# EAGLE design Sequencer2 (EAGLE 9.6.2)
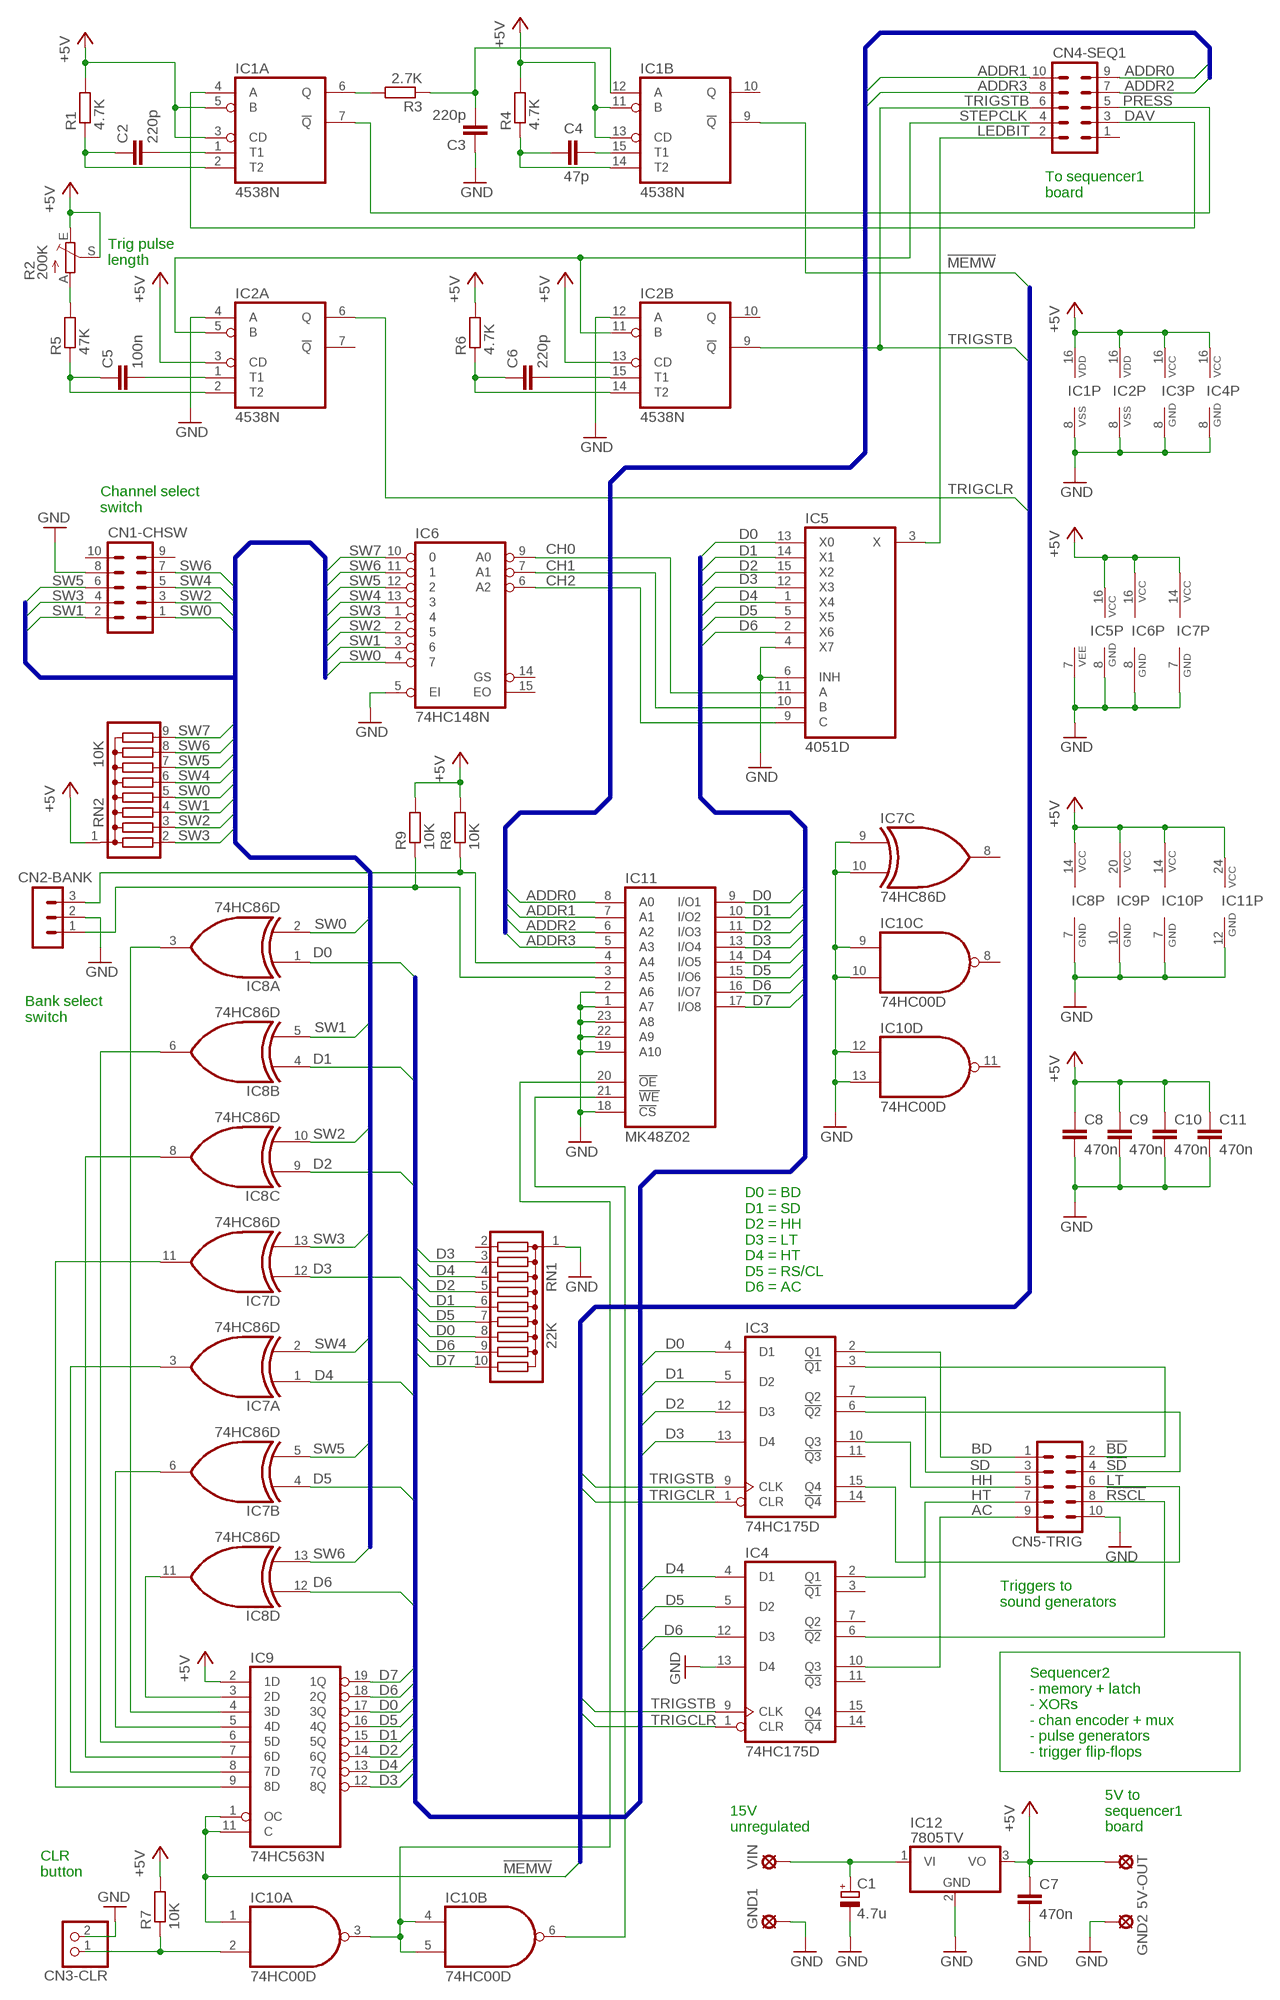
[diagram p0: schematic, sheet 1]

## Parts
5V-OUT  LSP10  [LSP10]
C1  4.7u  CPOL-EUSMCA  [SMC_A]
C2  220p  C-EUC0805  [C0805]
C3  220p  C-EUC0805  [C0805]
C4  47p  C-EUC0805  [C0805]
C5  100n  C-EUC0805  [C0805]
C6  220p  C-EUC0805  [C0805]
C7  470n  C-EUC0603  [C0603]
C8  470n  C-EUC0603  [C0603]
C9  470n  C-EUC0603  [C0603]
C10  470n  C-EUC0603  [C0603]
C11  470n  C-EUC0603  [C0603]
CN1-CHSW  MA05-2  [MA05-2]
CN2-BANK  MA03-1  [MA03-1]
CN3-CLR  PINHD-1X2  [1X02]
CN4-SEQ1  MA05-2  [MA05-2]
CN5-TRIG  MA05-2  [MA05-2]
GND1  LSP10  [LSP10]
GND2  LSP10  [LSP10]
IC1  4538N  [DIL16]
IC2  4538N  [DIL16]
IC3  74HC175D  [SO16]
IC4  74HC175D  [SO16]
IC5  4051D  [SO16]
IC6  74HC148N  74LS148N  [DIL16]
IC7  74HC86D  74LS86D  [SO14]
IC8  74HC86D  74LS86D  [SO14]
IC9  74HC563N  [DIL20]
IC10  74HC00D  74ALS00D  [SO14]
IC11  MK48Z02  6116P  [DIL24-6]
IC12  7805TV  [TO220V]
R1  4.7K  R-EU_R0805  [R0805]
R2  200K  TRIM_EU-S63X  [S63X]
R3  2.7K  R-EU_R0805  [R0805]
R4  4.7K  R-EU_R0805  [R0805]
R5  47K  R-EU_R0805  [R0805]
R6  4.7K  R-EU_R0805  [R0805]
R7  10K  R-EU_R0805  [R0805]
R8  10K  R-EU_R0805  [R0805]
R9  10K  R-EU_R0805  [R0805]
RN1  22K  G09R  [SIL10]
RN2  10K  G08R  [SIL9]
VIN  LSP10  [LSP10]

## Nets
!BD: CN5-TRIG.2 IC3.3(!Q1)
!MEMW: IC1.9(B:!Q) IC9.1(OC) IC9.11(C) IC10.1(A:I0)
!PRESS: CN4-SEQ1.5 IC1.7(A:!Q)
!RSCL: CN5-TRIG.8 IC4.6(!Q2)
!SD: CN5-TRIG.4 IC3.6(!Q2)
+5V: 5V-OUT.MP C7.1 C8.1 C9.1 C10.1 C11.1 IC1.3(A:CD) IC1.5(A:B) IC1.11(B:B) IC1.13(B:CD) IC1.16(P:VDD) IC2.3(A:CD) IC2.13(B:CD) IC2.16(P:VDD) IC3.16(VCC) IC4.16(VCC) IC5.16(VCC) IC6.16(VCC) IC7.14(P:VCC) IC8.14(P:VCC) IC9.2(1D) IC9.20(VCC) IC10.14(P:VCC) IC11.24(VCC) IC12.3(VO) R1.2 R2.E R2.S R4.2 R6.2 R7.2 R8.2 R9.2 RN2.1
AC: CN5-TRIG.9 IC4.10(Q3)
ADDR0: CN4-SEQ1.9 IC11.8(A0)
ADDR1: CN4-SEQ1.10 IC11.7(A1)
ADDR2: CN4-SEQ1.7 IC11.6(A2)
ADDR3: CN4-SEQ1.8 IC11.5(A3)
BD: CN5-TRIG.1 IC3.2(Q1)
CH0: IC5.11(A) IC6.9(A0)
CH1: IC5.10(B) IC6.7(A1)
CH2: IC5.9(C) IC6.6(A2)
D0: IC3.4(D1) IC5.13(X0) IC8.1(A:I0) IC9.17(3Q) IC11.9(I/O1) RN1.8
D1: IC3.5(D2) IC5.14(X1) IC8.4(B:I0) IC9.15(5Q) IC11.10(I/O2) RN1.6
D2: IC3.12(D3) IC5.15(X2) IC8.9(C:I0) IC9.14(6Q) IC11.11(I/O3) RN1.5
D3: IC3.13(D4) IC5.12(X3) IC7.12(D:I0) IC9.12(8Q) IC11.13(I/O4) RN1.3
D4: IC4.4(D1) IC5.1(X4) IC7.1(A:I0) IC9.13(7Q) IC11.14(I/O5) RN1.4
D5: IC4.5(D2) IC5.5(X5) IC7.4(B:I0) IC9.16(4Q) IC11.15(I/O6) RN1.7
D6: IC4.12(D3) IC5.2(X6) IC8.12(D:I0) IC9.18(2Q) IC11.16(I/O7) RN1.9
D7: IC9.19(1Q) IC11.17(I/O8) RN1.10
DAV: CN4-SEQ1.3 IC1.4(A:A)
GND: C1.- C3.1 C7.2 C8.2 C9.2 C10.2 C11.2 CN1-CHSW.8 CN2-BANK.2 CN3-CLR.2 CN5-TRIG.10 GND1.MP GND2.MP IC1.8(P:VSS) IC2.4(A:A) IC2.8(P:VSS) IC2.12(B:A) IC3.8(GND) IC4.8(GND) IC4.13(D4) IC5.4(X7) IC5.6(INH) IC5.7(VEE) IC5.8(GND) IC6.5(EI) IC6.8(GND) IC7.7(P:GND) IC7.9(C:I0) IC7.10(C:I1) IC8.7(P:GND) IC9.10(GND) IC10.7(P:GND) IC10.9(C:I0) IC10.10(C:I1) IC10.12(D:I0) IC10.13(D:I1) IC11.1(A7) IC11.2(A6) IC11.12(GND) IC11.18(!CS) IC11.19(A10) IC11.22(A9) IC11.23(A8) IC12.2(GND) RN1.1
HH: CN5-TRIG.5 IC3.10(Q3)
HT: CN5-TRIG.7 IC4.2(Q1)
LEDBIT: CN4-SEQ1.2 IC5.3(X)
LT: CN5-TRIG.6 IC3.15(Q4)
N$1: C5.2 IC2.1(A:T1)
N$2: C5.1 IC2.2(A:T2) R5.1
N$3: C2.2 IC1.1(A:T1)
N$4: C2.1 IC1.2(A:T2) R1.1
N$5: IC1.6(A:Q) R3.2
N$6: C3.2 IC1.12(B:A) R3.1
N$7: C4.2 IC1.14(B:T2) R4.1
N$8: C4.1 IC1.15(B:T1)
N$9: R2.A R5.2
N$10: C6.2 IC2.15(B:T1)
N$11: C6.1 IC2.14(B:T2) R6.1
N$15: IC8.3(A:O) IC9.4(3D)
N$16: IC8.6(B:O) IC9.6(5D)
N$17: IC8.8(C:O) IC9.7(6D)
N$18: IC7.11(D:O) IC9.9(8D)
N$19: IC7.3(A:O) IC9.8(7D)
N$20: IC7.6(B:O) IC9.5(4D)
N$21: IC8.11(D:O) IC9.3(2D)
N$22: CN2-BANK.1 IC11.3(A5) R9.1
N$23: CN3-CLR.1 IC10.2(A:I1) R7.1
N$24: C1.+ IC12.1(VI) VIN.MP
N$25: CN2-BANK.3 IC11.4(A4) R8.1
N$27: IC10.3(A:O) IC10.4(B:I0) IC10.5(B:I1) IC11.20(!OE)
N$28: IC10.6(B:O) IC11.21(!WE)
SD: CN5-TRIG.3 IC3.7(Q2)
STEPCLK: CN4-SEQ1.4 IC2.5(A:B) IC2.11(B:B)
SW0: CN1-CHSW.1 IC6.4 IC8.2(A:I1) RN2.5
SW1: CN1-CHSW.2 IC6.3 IC8.5(B:I1) RN2.4
SW2: CN1-CHSW.3 IC6.2 IC8.10(C:I1) RN2.3
SW3: CN1-CHSW.4 IC6.1 IC7.13(D:I1) RN2.2
SW4: CN1-CHSW.5 IC6.13 IC7.2(A:I1) RN2.6
SW5: CN1-CHSW.6 IC6.12 IC7.5(B:I1) RN2.7
SW6: CN1-CHSW.7 IC6.11 IC8.13(D:I1) RN2.8
SW7: IC6.10 RN2.9
TRIGCLR: IC2.6(A:Q) IC3.1(CLR) IC4.1(CLR)
TRIGSTB: CN4-SEQ1.6 IC2.9(B:!Q) IC3.9(CLK) IC4.9(CLK)
Unconnected: CN1-CHSW.9 CN1-CHSW.10 CN4-SEQ1.1 IC1.10(B:Q) IC2.7(A:!Q) IC2.10(B:Q) IC3.11(!Q3) IC3.14(!Q4) IC4.3(!Q1) IC4.7(Q2) IC4.11(!Q3) IC4.14(!Q4) IC4.15(Q4) IC6.14(GS) IC6.15(EO) IC7.8(C:O) IC10.8(C:O) IC10.11(D:O) RN1.2

## Buses
B$1
B$2
B$3
B$4

## Notes on the sheet
- To sequencer1
  board
- Trig pulse
  length
- Channel select
  switch
- Bank select
  switch
- D0 = BD
  D1 = SD
  D2 = HH
  D3 = LT
  D4 = HT
  D5 = RS/CL
  D6 = AC
- Triggers to
  sound generators
- Sequencer2
  - memory + latch
  - XORs
  - chan encoder + mux
  - pulse generators
  - trigger flip-flops
- 15V
  unregulated
- 5V to 
  sequencer1
  board
- CLR
  button

## Library data of the parts
5V-OUT GND1 GND2 VIN = solpad:LSP10: SOLDER PAD drill 1.0 mm, distributor Buerklin, 12H555
C1 = rcl:CPOL-EU: POLARIZED CAPACITOR, European symbol
C2-C11 = rcl:C-EU: CAPACITOR, European symbol
CN1-CHSW CN4-SEQ1 CN5-TRIG = con-lstb:MA05-2: PIN HEADER; OC_FARNELL: unknown; OC_NEWARK: unknown
CN2-BANK = con-lstb:MA03-1: PIN HEADER; OC_FARNELL: unknown; OC_NEWARK: unknown
CN3-CLR = pinhead:PINHD-1X2: PIN HEADER
IC1 IC2 = 45xx:4538: Dual precision monostable MULTIVIBRATOR
IC3 IC4 = 74xx-eu:74*175: Qadruple D type FLIP FLOP, clear
IC5 = 40xx:4051: 8-channel ANALOG MULTIPLEXER
IC6 = 74xx-us:74*148: 10-line to 4-line and 8-line to 3-line PRIORITY ENCODER
IC7 IC8 = 74xx-us:74*86: Quad 2-input EXCLUSIV-OR (XOR) gate
IC9 = 74xx-us:74*563: Inverting 8-bit D type LATCH
IC10 = 74xx-us:74*00: Quad 2-input NAND gate
IC11 = memory-idt:6116P: MEMORY; OC_FARNELL: unknown; OC_NEWARK: unknown
IC12 = linear:78*: Positive VOLTAGE REGULATOR Source: http://cache.national.com/ds/LM/LM78L05.pdf http://www.fairchildsemi.com/ds/LM/LM7805.pdf
R1 R3-R9 = rcl:R-EU_: RESISTOR, European symbol
R2 = pot:TRIM_EU-: POTENTIOMETER
RN1 = resistor-sil:G09R: SIL RESISTOR; OC_FARNELL: unknown; OC_NEWARK: unknown
RN2 = resistor-sil:G08R: SIL RESISTOR; OC_FARNELL: unknown; OC_NEWARK: unknown

## Board
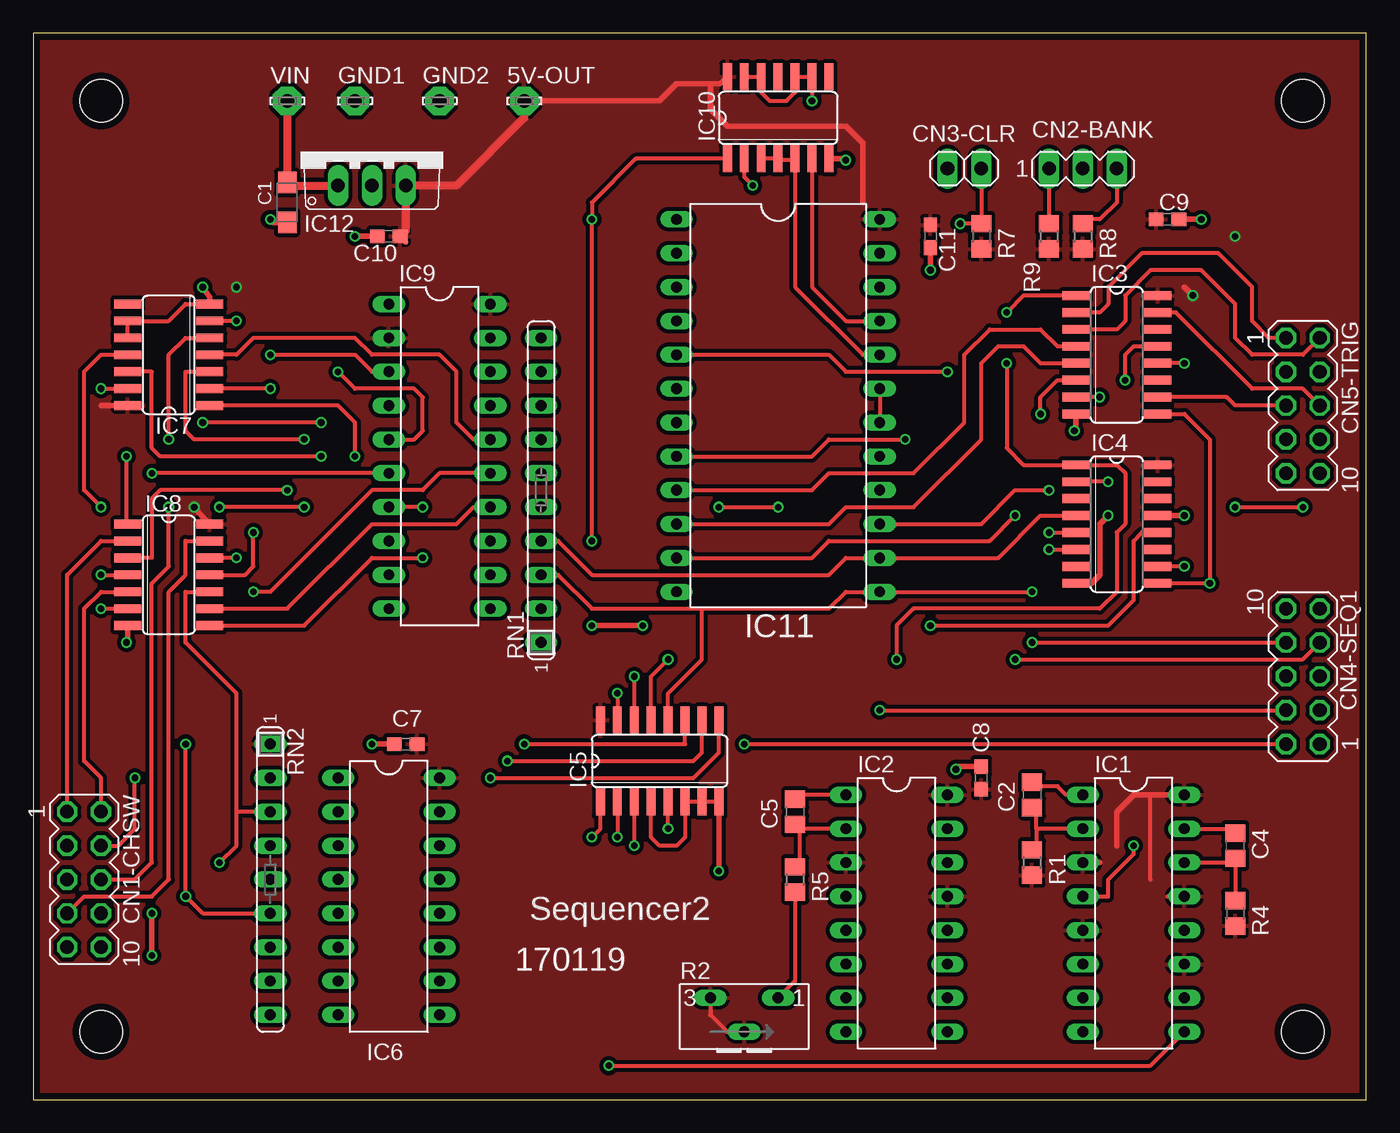
[diagram p1: board, top side]
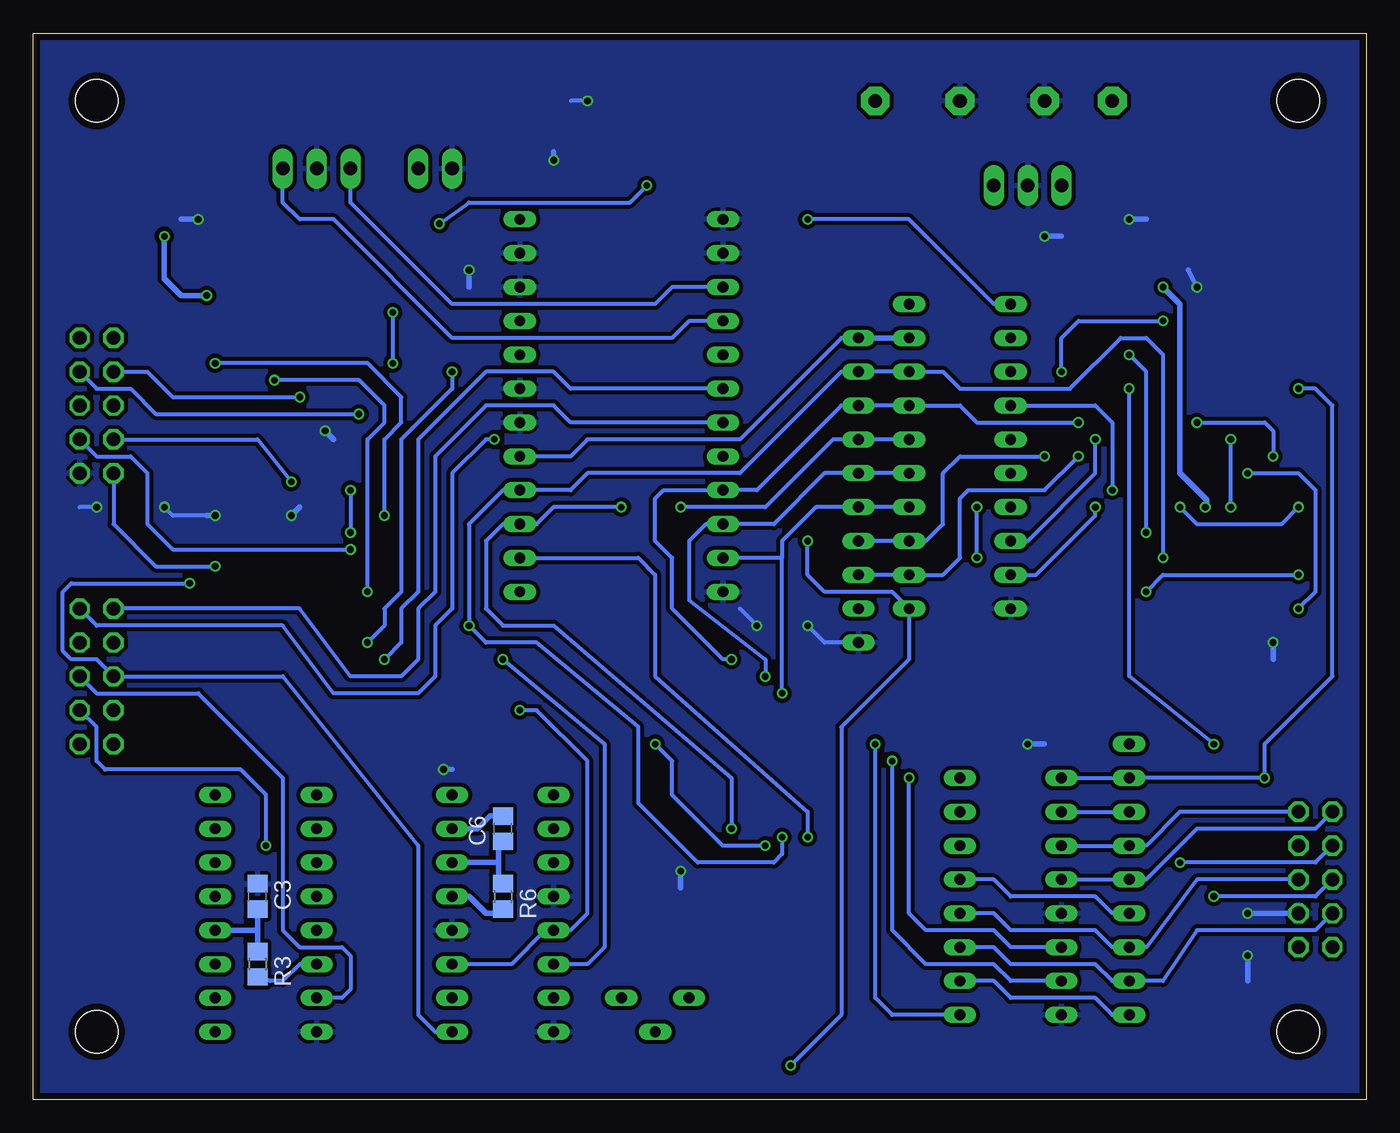
[diagram p2: board, bottom side, seen from below]

Size 100 x 80 mm. Coordinates in mm from the lower left corner, seen from the top.
Outline: 0,0 100,0 100,80 0,80 0,0
Copper layers (1*16): Top 0.035mm / dielectric 1.6mm / Bottom 0.035mm
Design rules "Elecrow_2-layer_PCB_eagle_rule": minimum track width 6mil, minimum drill 12mil, track to track 6mil, track to pad 6mil, pad to pad 6mil, via to via 8mil, smd to smd 0mil, copper to edge 20mil, drill to drill 10mil, minimum pad ring 6mil, minimum via ring 6mil, stop-mask expansion 0mil, vias tented up to drill 100mil, thermal gap 10mil
Holes 3.2 mm at 5.08,74.93 95.25,74.93 5.08,5.08 95.25,5.08

### Footprints (pad centres in the part's own frame; a part is rotated, then mirrored left to right if it is on the bottom)
LSP10 = drill 1.016 pad 2.159 octagon: MP 0,0
SMC_A = smd 1.6 x 1.4: + -1.5,0; - 1.5,0
C0805 = smd 1.3 x 1.5: 1 -0.95,0; 2 0.95,0
C0603 = smd 1.1 x 1: 1 -0.85,0; 2 0.85,0
MA05-2 = drill 1.016 octagon: 1 -5.08,-1.27; 2 -5.08,1.27; 3 -2.54,-1.27; 4 -2.54,1.27; 5 0,-1.27; 6 0,1.27; 7 2.54,-1.27; 8 2.54,1.27; 9 5.08,-1.27; 10 5.08,1.27
MA03-1 = drill 1.016 long: 1 -2.54,0; 2 0,0; 3 2.54,0
1X02 = drill 1.016 long: 1 -1.27,0; 2 1.27,0
DIL16 = drill 0.813 long: 1 -8.89,-3.81; 2 -6.35,-3.81; 3 -3.81,-3.81; 4 -1.27,-3.81; 5 1.27,-3.81; 6 3.81,-3.81; 7 6.35,-3.81; 8 8.89,-3.81; 9 8.89,3.81; 10 6.35,3.81; 11 3.81,3.81; 12 1.27,3.81; 13 -1.27,3.81; 14 -3.81,3.81; 15 -6.35,3.81; 16 -8.89,3.81
SO16 = smd 0.66 x 2.032: 1 -4.445,-3.073; 2 -3.175,-3.073; 3 -1.905,-3.073; 4 -0.635,-3.073; 5 0.635,-3.073; 6 1.905,-3.073; 7 3.175,-3.073; 8 4.445,-3.073; 9 4.445,3.073; 10 3.175,3.073; 11 1.905,3.073; 12 0.635,3.073; 13 -0.635,3.073; 14 -1.905,3.073; 15 -3.175,3.073; 16 -4.445,3.073
SO14 = smd 0.66 x 2.032: 1 -3.81,-3.073; 2 -2.54,-3.073; 3 -1.27,-3.073; 4 0,-3.073; 5 1.27,-3.073; 6 2.54,-3.073; 7 3.81,-3.073; 8 3.81,3.073; 9 2.54,3.073; 10 1.27,3.073; 11 0,3.073; 12 -1.27,3.073; 13 -2.54,3.073; 14 -3.81,3.073
DIL20 = drill 0.813 long: 1 -11.43,-3.81; 2 -8.89,-3.81; 3 -6.35,-3.81; 4 -3.81,-3.81; 5 -1.27,-3.81; 6 1.27,-3.81; 7 3.81,-3.81; 8 6.35,-3.81; 9 8.89,-3.81; 10 11.43,-3.81; 11 11.43,3.81; 12 8.89,3.81; 13 6.35,3.81; 14 3.81,3.81; 15 1.27,3.81; 16 -1.27,3.81; 17 -3.81,3.81; 18 -6.35,3.81; 19 -8.89,3.81; 20 -11.43,3.81
DIL24-6 = drill 0.813 long: 1 -13.97,-7.62; 2 -11.43,-7.62; 3 -8.89,-7.62; 4 -6.35,-7.62; 5 -3.81,-7.62; 6 -1.27,-7.62; 7 1.27,-7.62; 8 3.81,-7.62; 9 6.35,-7.62; 10 8.89,-7.62; 11 11.43,-7.62; 12 13.97,-7.62; 13 13.97,7.62; 14 11.43,7.62; 15 8.89,7.62; 16 6.35,7.62; 17 3.81,7.62; 18 1.27,7.62; 19 -1.27,7.62; 20 -3.81,7.62; 21 -6.35,7.62; 22 -8.89,7.62; 23 -11.43,7.62; 24 -13.97,7.62
TO220V = drill 1.016 long: 1 -2.54,-2.54; 2 0,-2.54; 3 2.54,-2.54
R0805 = smd 1.3 x 1.5: 1 -0.95,0; 2 0.95,0
S63X = drill 0.813 long: A 2.54,0; E -2.54,0; S 0,-2.54
SIL10 = drill 0.813 long: 1 -11.43,0; 2 -8.89,0; 3 -6.35,0; 4 -3.81,0; 5 -1.27,0; 6 1.27,0; 7 3.81,0; 8 6.35,0; 9 8.89,0; 10 11.43,0
SIL9 = drill 0.813 long: 1 -10.16,0; 2 -7.62,0; 3 -5.08,0; 4 -2.54,0; 5 0,0; 6 2.54,0; 7 5.08,0; 8 7.62,0; 9 10.16,0

### Placement (x,y rotation side)
5V-OUT  36.83,74.93 0 top
C1  19.05,67.31 270 top
C2  74.93,22.86 90 top
C3  83.19,15.24 270 bottom
C4  90.17,19.05 270 top
C5  57.15,21.59 90 top
C6  64.77,20.32 90 bottom
C7  27.94,26.67 180 top
C8  71.12,24.13 90 top
C9  85.09,66.04 0 top
C10  26.67,64.77 180 top
C11  67.31,64.77 270 top
CN1-CHSW  3.81,16.51 270 top
CN2-BANK  78.74,69.85 0 top
CN3-CLR  69.85,69.85 180 top
CN4-SEQ1  95.25,31.75 90 top
CN5-TRIG  95.25,52.07 270 top
GND1  24.13,74.93 0 top
GND2  30.48,74.93 0 top
IC1  82.55,13.97 270 top
IC2  64.77,13.97 270 top
IC3  81.28,55.88 270 top
IC4  81.28,43.18 270 top
IC5  46.99,25.4 0 top
IC6  26.67,15.24 270 top
IC7  10.16,55.88 90 top
IC8  10.16,39.37 270 top
IC9  30.48,48.26 270 top
IC10  55.88,73.66 0 top
IC11  55.88,52.07 270 top
IC12  25.4,71.12 0 top
R1  74.93,17.78 270 top
R2  53.34,7.62 0 top
R3  83.19,10.16 270 bottom
R4  90.17,13.97 270 top
R5  57.15,16.51 270 top
R6  64.77,15.24 270 bottom
R7  71.12,64.77 270 top
R8  78.74,64.77 270 top
R9  76.2,64.77 270 top
RN1  38.1,45.72 90 top
RN2  17.78,16.51 270 top
VIN  19.05,74.93 0 top

### Tracks (layer width: path | path; a pad name or v marks a point on that pad's centre or on a via)
!BD
  Top 0.305: CN5-TRIG.2 95.25,55.88 91.44,55.88 90.17,57.15 90.17,59.69 87.63,62.23 83.82,62.23 81.92,60.33 81.92,58.42 81.28,57.78 IC3.3
!MEMW  (via drill 0.5)
  Top 0.305: v43.18,2.54 83.82,2.54 IC1.9 | IC10.1 45.19,70.59 41.91,67.31 v41.91,66.04 v41.91,41.91
  Bottom 0.305: v43.18,2.54 39.37,6.35 39.37,27.94 34.29,33.02 IC9.11 35.56,38.1 40.64,38.1 41.91,39.37 v41.91,41.91 | IC9.1 27.94,59.69 34.29,66.04 v41.91,66.04
!PRESS
  Bottom 0.305: CN4-SEQ1.5 95.25,30.48 87.63,30.48 81.28,24.13 81.28,12.7 80.01,11.43 76.83,11.43 76.2,10.79 76.2,8.26 76.83,7.62 IC1.7
!RSCL  (via drill 0.5)
  Top 0.305: v76.2,41.27 IC4.6
  Bottom 0.305: CN5-TRIG.8 95.25,48.26 92.71,48.26 91.44,46.99 91.44,43.18 89.53,41.27 v76.2,41.27
!SD  (via drill 0.5)
  Top 0.305: v75.56,51.44 75.56,52.7 76.83,53.98 IC3.6
  Bottom 0.305: CN5-TRIG.4 95.25,53.34 92.71,53.34 90.81,51.44 v75.56,51.44
+5V  (via drill 0.5)
  Top 0.305: R2.E 50.8,6.35 52.07,5.08 R2.S | 85.09,15.24 IC1.13 87,15.24 | 83.82,16.51 83.82,22.86
  Top 0.406: 27.94,64.35 C10.1 | IC7.14 5.08,52.07 | v12.06,44.45 12.7,43.71 IC8.14 | IC1.3 80.01,17.78 | 81.28,19.05 81.28,21.59 82.55,22.86 83.82,22.86 IC1.16 | 5V-OUT.MP 46.99,74.93 48.26,76.2 50.8,76.2 | 50.8,76.2 51.54,76.2 IC10.14 | 62.23,67.31 62.23,71.75 60.96,73.03 52.07,73.03 50.8,74.3 50.8,76.2 | v87,60.33 86.36,60.96
  Top 0.61: 5V-OUT.MP 36.83,73.66 31.75,68.58 IC12.3 27.94,65.19 C10.1
  Bottom 0.406: v15.24,60.96 13.97,59.69 13.97,46.99 11.96,44.98 11.96,44.55 v12.06,44.45 | 64.45,13.97 R6.2 65.09,13.97 66.04,13.97 67.31,15.24 IC2.13 | v90.17,64.77 90.17,61.59 88.9,60.33 v87,60.33
  pour Top (isolate 0.305): -2.54,82.55 102.87,82.55 102.87,-2.54 -2.54,-2.54
AC  (via drill 0.5)
  Top 0.305: v86.36,40.01 IC4.10
  Bottom 0.305: CN5-TRIG.9 93.98,43.18 90.81,40.01 v86.36,40.01
ADDR0  (via drill 0.5)
  Top 0.305: IC11.8 58.42,48.26 59.69,49.53 v65.41,49.53
  Bottom 0.305: v65.41,49.53 66.04,49.53 68.58,46.99 68.58,36.83 69.85,35.56 69.85,31.75 71.12,30.48 77.47,30.48 81.28,35.56 95.25,35.56 CN4-SEQ1.9
ADDR1
  Bottom 0.305: IC11.7 59.69,50.8 60.96,52.07 66.04,52.07 69.85,48.26 69.85,38.1 71.12,36.83 71.12,33.02 72.39,31.75 76.2,31.75 80.01,36.83 CN4-SEQ1.10
ADDR2  (via drill 0.5)
  Top 0.305: v73.66,33.02 95.25,33.02 CN4-SEQ1.7
  Bottom 0.305: IC11.6 59.69,53.34 60.96,54.61 66.04,54.61 71.12,49.53 71.12,38.1 72.39,36.83 72.39,34.29 v73.66,33.02
ADDR3  (via drill 0.5)
  Top 0.305: IC11.5 59.69,55.88 60.96,54.61 v68.58,54.61 | v74.93,34.29 CN4-SEQ1.8
  Bottom 0.305: v68.58,54.61 68.58,53.34 72.39,49.53 72.39,38.1 73.66,36.83 73.66,35.56 v74.93,34.29
BD
  Top 0.305: CN5-TRIG.1 92.71,57.15 91.44,58.42 91.44,60.96 88.9,63.5 83.19,63.5 80.64,60.96 80.64,59.69 80.01,59.05 IC3.2
CH0  (via drill 0.5)
  Top 0.305: v36.83,26.67 48.9,26.67 IC5.11
  Bottom 0.305: IC6.9 35.56,6.35 36.83,7.62 v36.83,26.67
CH1  (via drill 0.5)
  Top 0.305: v35.56,25.4 49.53,25.4 50.16,26.04 IC5.10
  Bottom 0.305: IC6.7 26.67,8.89 27.94,10.16 33.02,10.16 35.56,12.7 v35.56,25.4
CH2  (via drill 0.5)
  Top 0.305: v34.29,24.13 49.53,24.13 51.44,26.04 IC5.9
  Bottom 0.305: IC6.6 26.67,11.43 27.94,12.7 33.02,12.7 34.29,13.97 v34.29,24.13
D0  (via drill 0.5)
  Top 0.305: IC11.9 58.42,45.72 59.69,46.99 66.04,46.99 69.85,50.8 69.85,55.88 71.75,57.78 75.56,57.78 76.83,56.52 IC3.4 | IC5.13 46.35,31.75 v47.62,33.02 | v21.59,50.8 v12.7,50.8 | v6.99,48.26 6.99,43.28 IC8.1
  Bottom 0.305: v47.62,33.02 48.26,33.02 52.07,36.83 52.07,40.64 53.34,41.91 53.34,45.09 52.7,45.72 IC11.9 45.72,45.72 39.37,52.07 RN1.8 IC9.17 30.48,52.07 29.21,50.8 v21.59,50.8 | v12.7,50.8 7.62,50.8 6.99,50.16 v6.99,48.26
D1  (via drill 0.5)
  Top 0.305: IC11.10 59.69,43.18 60.96,44.45 66.04,44.45 71.12,49.53 71.12,55.24 72.39,56.52 74.3,56.52 75.56,55.24 IC3.5 | v45.09,31.75 IC5.14 | IC9.15 30.48,46.99 29.21,45.72 25.4,45.72 17.78,38.1 v16.51,38.1 | v5.08,39.37 IC8.4
  Bottom 0.305: v45.09,31.75 45.09,33.02 50.8,37.47 50.8,41.91 49.53,43.18 IC11.10 44.45,43.18 40.64,46.99 RN1.6 IC9.15 | v16.51,38.1 15.24,39.37 v5.08,39.37
D2  (via drill 0.5)
  Top 0.305: IC11.11 58.42,40.64 59.69,41.91 71.75,41.91 v73.66,43.81 | v86.36,55.24 IC3.12 | v43.81,30.48 IC5.15 | IC8.9 19.05,36.83 25.4,43.18 31.75,43.18 33.02,44.45 IC9.14
  Bottom 0.305: 43.81,40.64 43.81,41.91 41.27,44.45 RN1.5 IC9.14 | 43.81,40.64 IC11.11 | v73.66,43.81 73.66,49.53 72.39,50.8 72.39,52.7 74.93,55.24 v86.36,55.24 | v43.81,30.48 43.81,40.64
D3  (via drill 0.5)
  Top 0.305: RN1.3 39.37,39.37 41.91,36.83 50.16,36.83 | 50.16,36.83 59.69,36.83 60.96,38.1 IC11.13 v74.93,38.1 | v81.92,53.98 81.92,55.88 82.55,56.52 IC3.13 | IC5.12 47.62,30.48 50.16,33.02 50.16,36.83 | v21.59,48.26 9.53,48.26 8.89,48.9 8.89,54.61 IC7.12
  Bottom 0.305: v74.93,38.1 74.93,49.53 73.66,50.8 73.66,52.07 75.56,53.98 v81.92,53.98 | v21.59,48.26 24.13,45.72 29.84,45.72 30.48,45.09 30.48,40.64 31.75,39.37 IC9.12 RN1.3
D4  (via drill 0.5)
  Top 0.305: RN1.4 39.37,41.91 41.91,39.37 59.69,39.37 60.96,40.64 IC11.14 72.39,40.64 75.56,43.81 IC4.4 | v24.13,48.26 24.13,50.8 22.86,52.07 IC7.1 | v41.91,19.68 42.55,20.32 IC5.1
  Bottom 0.305: IC11.14 54.61,40.64 53.34,39.37 53.34,31.75 41.91,21.59 v41.91,19.68 | v24.13,48.26 30.48,48.26 31.75,46.99 31.75,43.18 33.02,41.91 IC9.13 RN1.4
D5  (via drill 0.5)
  Top 0.305: IC11.15 71.12,43.18 73.66,45.72 v76.2,45.72 | v76.2,42.55 IC4.5 | IC9.16 33.02,49.53 31.75,50.8 31.75,54.61 30.48,55.88 25.4,55.88 24.13,57.15 16.51,57.15 15.24,55.88 IC7.4 | v47.62,20.32 IC5.5 | v51.44,44.45 v55.88,44.45
  Bottom 0.305: v76.2,45.72 v76.2,42.55 | IC9.16 RN1.7 40.01,49.53 45.09,44.45 v51.44,44.45 | v47.62,20.32 47.62,24.13 60.96,35.56 64.77,35.56 66.04,36.83 66.04,41.91 64.77,43.18 IC11.15 62.23,43.18 60.96,44.45 v55.88,44.45
D6  (via drill 0.5)
  Top 0.305: v67.31,35.56 80.64,35.56 82.55,37.47 82.55,41.91 83.19,42.55 IC4.12 | IC5.2 v43.81,19.68 | v15.24,40.64 IC8.12
  Bottom 0.305: v43.81,19.68 43.81,18.41 44.45,17.78 50.16,17.78 54.61,22.23 54.61,27.94 62.23,34.29 66.04,34.29 v67.31,35.56 67.31,43.18 64.77,45.72 IC11.16 59.69,45.72 58.42,46.99 46.99,46.99 39.37,54.61 RN1.9 IC9.18 31.75,54.61 30.48,53.34 22.23,53.34 18.41,57.15 16.51,57.15 15.24,55.88 v15.24,40.64
D7
  Bottom 0.305: RN1.10 39.37,57.15 46.99,49.53 58.42,49.53 59.69,48.26 IC11.17
  Bottom 0.406: IC9.19 RN1.10
DAV  (via drill 0.5)
  Top 0.305: IC1.4 80.64,15.24 80.64,16.51 82.55,18.41 v82.55,19.05
  Bottom 0.305: v82.55,19.05 82.55,22.86 84.45,24.77 94.61,24.77 95.25,25.4 95.25,27.94 CN4-SEQ1.3
GND  (via drill 0.5)
  Top 0.305: IC10.13 IC10.12 54.61,75.56 55.24,74.93 56.52,74.93 57.15,75.56 IC10.10 IC10.9 v58.42,74.93 | IC7.10 IC7.9 10.16,58.42 11.43,59.69 IC7.7 | IC5.8 IC5.7 IC5.6 48.9,19.68 48.26,19.05 46.99,19.05 46.35,19.68 IC5.4 | IC11.19 IC11.18 | v90.17,44.45 v95.25,44.45
  Top 0.406: C1.- 18.01,65.81 v17.78,66.04 | C10.2 v24.13,64.77 | C11.2 v67.31,62.23 | C9.2 v87.63,66.04 | IC3.8 78.21,50.27 v78.11,50.16 | IC10.7 60.86,70.59 v60.96,70.48 | IC7.7 13.23,60.22 v12.7,60.96 | IC8.7 7.09,34.39 v6.99,34.29 | IC5.8 v51.44,17.14 | C8.2 69.43,24.98 v69.22,24.77 | C7.2 v25.4,26.67 | v41.91,35.56 v45.72,35.56 | IC4.13 v86.36,43.81 | IC4.8 79.38,38.73 80.01,39.37 80.01,43.18 v80.64,43.81 | v8.89,13.97 v8.89,10.79
  Bottom 0.305: v58.42,74.93 59.69,74.93 | RN1.1 40.64,34.29 v41.91,35.56 | v45.72,35.56 46.99,36.83 | v86.36,43.81 89.53,43.81 v90.17,44.45 | v95.25,44.45 96.52,44.45
  Bottom 0.406: v17.78,66.04 16.51,66.04 | v24.13,64.77 22.86,64.77 | v67.31,62.23 67.31,60.96 | v87.63,66.04 88.9,66.04 | v78.11,50.16 77.47,49.53 | v60.96,70.48 60.96,71.12 | v12.7,60.96 13.34,62.23 | v6.99,34.29 6.99,33.02 | v51.44,17.14 51.44,15.88 | v69.22,24.77 68.58,24.77 | v25.4,26.67 24.13,26.67 | v86.36,43.81 87,43.81 | v80.64,43.81 80.01,44.45 | CN1-CHSW.8 v8.89,13.97 | v8.89,10.79 8.89,8.89
  pour Bottom (isolate 0.305): -1.27,81.28 101.6,81.28 101.6,-1.27 -1.27,-1.27
HH
  Top 0.305: CN5-TRIG.5 90.17,52.07 89.53,52.7 IC3.10
HT  (via drill 0.5)
  Top 0.305: v80.64,46.35 IC4.2
  Bottom 0.305: CN5-TRIG.7 83.19,49.53 v80.64,46.35
LEDBIT  (via drill 0.5)
  Top 0.305: IC5.3 v45.09,19.05 | v53.34,26.67 CN4-SEQ1.2
  Bottom 0.305: v45.09,19.05 48.26,19.05 52.07,22.86 52.07,25.4 v53.34,26.67
LT
  Top 0.305: CN5-TRIG.6 95.25,53.34 91.44,53.34 85.72,59.05 IC3.15
N$1
  Top 0.305: IC2.1 57.47,22.86 C5.2
N$2
  Top 0.305: IC2.2 57.47,20.32 | 57.47,20.32 C5.1 | 57.47,20.32 57.47,17.78 R5.1
N$3
  Top 0.305: IC1.1 77.47,22.86 76.83,23.5 75.25,23.5 C2.2
N$4
  Top 0.305: IC1.2 75.25,20.32 | 75.25,20.32 75.25,21.27 74.93,21.59 C2.1 | 75.25,20.32 75.25,19.05 75.25,18.73 74.93,19.05 R1.1
N$5
  Bottom 0.305: 82.23,8.89 R3.2 82.86,8.89 81.28,8.89 80.01,10.16 IC1.6
N$6
  Bottom 0.406: IC1.12 83.19,12.7 | C3.2 83.19,12.7 | 83.19,12.7 R3.1
N$7
  Top 0.305: IC1.14 89.85,17.78 C4.2 R4.1
N$8
  Top 0.305: IC1.15 89.85,20.32 C4.1
N$9
  Top 0.305: R5.2 57.15,8.89 R2.A
N$10
  Bottom 0.406: IC2.15 66.67,20.32 65.72,21.27 C6.2
N$11
  Bottom 0.406: IC2.14 65.09,17.78 | 65.09,17.78 65.09,18.73 64.77,19.05 C6.1 | 65.09,17.78 65.09,16.51 R6.1
N$15  (via drill 0.5)
  Top 0.305: v19.05,45.72 9.53,45.72 8.89,45.09 8.89,40.64 IC8.3
  Bottom 0.305: IC9.4 20.32,52.07 19.05,50.8 v19.05,45.72
N$16  (via drill 0.5)
  Top 0.305: IC9.6 v8.89,46.99 | v5.08,36.83 IC8.6
  Bottom 0.305: v8.89,46.99 5.08,46.99 3.81,45.72 3.81,38.1 v5.08,36.83
N$17  (via drill 0.5)
  Top 0.305: IC8.8 20.32,35.56 25.4,40.64 v29.21,40.64 | v29.21,44.45 IC9.7
  Bottom 0.305: v29.21,40.64 v29.21,44.45
N$18  (via drill 0.5)
  Top 0.305: v20.32,44.45 v13.97,44.45 | v5.08,44.45 3.81,45.72 3.81,54.61 5.08,55.88 IC7.11
  Bottom 0.305: IC9.9 24.77,39.37 20.32,43.81 v20.32,44.45 | v13.97,44.45 12.7,43.18 6.35,43.18 v5.08,44.45
N$19  (via drill 0.5)
  Top 0.305: v20.32,49.53 12.06,49.53 11.43,50.16 11.43,54.61 IC7.3
  Bottom 0.305: IC9.8 25.4,41.91 20.32,46.99 v20.32,49.53
N$20  (via drill 0.5)
  Top 0.305: IC9.5 28.57,49.53 29.21,50.16 29.21,52.7 28.57,53.34 24.13,53.34 v22.86,54.61 | v15.24,58.42 IC7.6
  Bottom 0.305: v22.86,54.61 22.86,57.15 21.59,58.42 v15.24,58.42
N$21  (via drill 0.5)
  Top 0.305: IC8.11 15.88,39.37 16.51,40.01 v16.51,42.55 | v17.78,55.88 24.13,55.88 25.4,54.61 IC9.3
  Bottom 0.305: v16.51,42.55 16.51,54.61 v17.78,55.88
N$22
  Top 0.305: CN2-BANK.1 R9.1
  Bottom 0.305: IC11.3 52.07,60.96 53.34,59.69 68.58,59.69 76.2,67.31 CN2-BANK.1
N$23  (via drill 0.5)
  Top 0.305: CN3-CLR.1 R7.1 v69.53,65.72 | v53.98,68.58 53.34,69.22 IC10.2
  Bottom 0.305: v69.53,65.72 67.31,67.31 55.24,67.31 v53.98,68.58
N$24
  Top 0.61: VIN.MP C1.+ 18.82,68.81 19.05,68.58 IC12.1
N$25
  Top 0.305: CN2-BANK.3 81.28,67.31 80.01,66.04 79.06,66.04 R8.1
  Bottom 0.305: IC11.4 50.8,58.42 52.07,57.15 68.58,57.15 77.47,66.04 80.01,66.04 81.28,67.31 CN2-BANK.3
N$27
  Top 0.305: IC10.5 57.15,70.48 | 57.15,70.48 55.98,70.48 IC10.4 IC10.3 | 57.15,70.48 57.15,60.96 62.23,55.88 IC11.20
N$28
  Top 0.305: IC10.6 58.42,60.96 60.96,58.42 IC11.21
SD  (via drill 0.5)
  Top 0.305: v80.01,52.7 IC3.7
  Bottom 0.305: CN5-TRIG.3 91.44,54.61 89.53,52.7 v80.01,52.7
STEPCLK  (via drill 0.5)
  Top 0.305: v63.5,29.21 CN4-SEQ1.4
  Bottom 0.305: IC2.11 64.14,10.16 61.59,12.7 IC2.5 59.69,12.7 58.42,13.97 58.42,25.4 62.23,29.21 v63.5,29.21
SW0
  Top 0.305: CN1-CHSW.1 2.54,39.37 5.08,41.91 IC8.2
  Bottom 0.305: IC6.4 RN2.5 16.51,16.51 12.7,20.32 3.81,20.32 CN1-CHSW.1
SW1
  Top 0.305: CN1-CHSW.2 5.08,24.13 3.81,25.4 3.81,36.83 5.08,38.1 IC8.5
  Bottom 0.305: IC6.3 RN2.4 16.51,19.05 13.97,21.59 CN1-CHSW.2
SW2  (via drill 0.5)
  Top 0.305: v13.97,17.78 15.24,19.05 15.24,21.59 | RN2.3 15.24,21.59 | 15.24,21.59 15.24,30.48 11.43,34.29 11.43,38.1 IC8.10
  Bottom 0.305: IC6.2 RN2.3 | CN1-CHSW.3 3.81,17.78 v13.97,17.78
SW3  (via drill 0.5)
  Top 0.305: CN1-CHSW.4 6.35,19.05 7.62,20.32 v7.62,24.13 | v5.08,53.34 IC7.13
  Bottom 0.305: v5.08,53.34 3.81,53.34 2.54,52.07 2.54,31.75 7.62,26.67 v7.62,24.13 RN2.2 IC6.1
SW4  (via drill 0.5)
  Top 0.305: RN2.6 12.7,13.97 v11.43,15.24 v11.43,26.67 | v17.78,53.34 IC7.2
  Bottom 0.305: RN2.6 19.05,13.97 20.32,15.24 26.67,15.24 27.94,16.51 IC6.13 | CN1-CHSW.5 3.81,15.24 v11.43,15.24 | v11.43,26.67 17.78,31.75 v17.78,53.34
SW5  (via drill 0.5)
  Top 0.305: CN1-CHSW.6 7.62,16.51 8.89,17.78 8.89,38.73 10.16,40.01 v10.16,44.45 | v10.16,49.53 10.16,55.88 11.43,57.15 IC7.5
  Bottom 0.305: IC6.12 27.94,13.97 26.67,12.7 20.32,12.7 19.05,11.43 RN2.7 16.51,11.43 12.7,16.51 CN1-CHSW.6 | v10.16,44.45 v10.16,49.53
SW6
  Top 0.305: CN1-CHSW.7 3.81,15.24 8.89,15.24 10.16,16.51 10.16,38.1 11.43,39.37 11.43,41.91 IC8.13
  Bottom 0.305: IC6.11 27.94,11.43 26.67,10.16 20.32,10.16 19.05,8.89 RN2.8 15.24,8.89 12.7,12.7 3.81,12.7 CN1-CHSW.7
SW7
  Bottom 0.305: RN2.9 19.05,6.35 20.32,7.62 26.67,7.62 27.94,8.89 IC6.10
TRIGCLR  (via drill 0.5)
  Top 0.305: IC3.1 74.3,60.33 v73.03,59.05 | v73.03,55.24 73.03,48.9 74.3,47.62 IC4.1 81.28,47.62 81.92,46.99 81.92,43.18 81.28,42.55 81.28,38.1 80.01,36.83 66.04,36.83 64.77,35.56 v64.77,33.02
  Bottom 0.305: v73.03,59.05 v73.03,55.24 | v64.77,33.02 57.15,26.67 57.15,11.43 58.42,10.16 IC2.6
TRIGSTB  (via drill 0.5)
  Top 0.305: IC3.9 86.36,51.44 88.27,49.53 v88.27,38.73 IC4.9
  Bottom 0.305: v88.27,38.73 97.16,38.73 97.79,38.1 97.79,33.66 97.16,33.02 95.25,33.02 CN4-SEQ1.6 81.28,31.75 71.12,19.05 71.12,6.35 69.85,5.08 IC2.9

### Text on the board
tNames: Sequencer2 | 170119